# Altium project GrappleRobot_ControlBoard_V1.0.PrjPcb
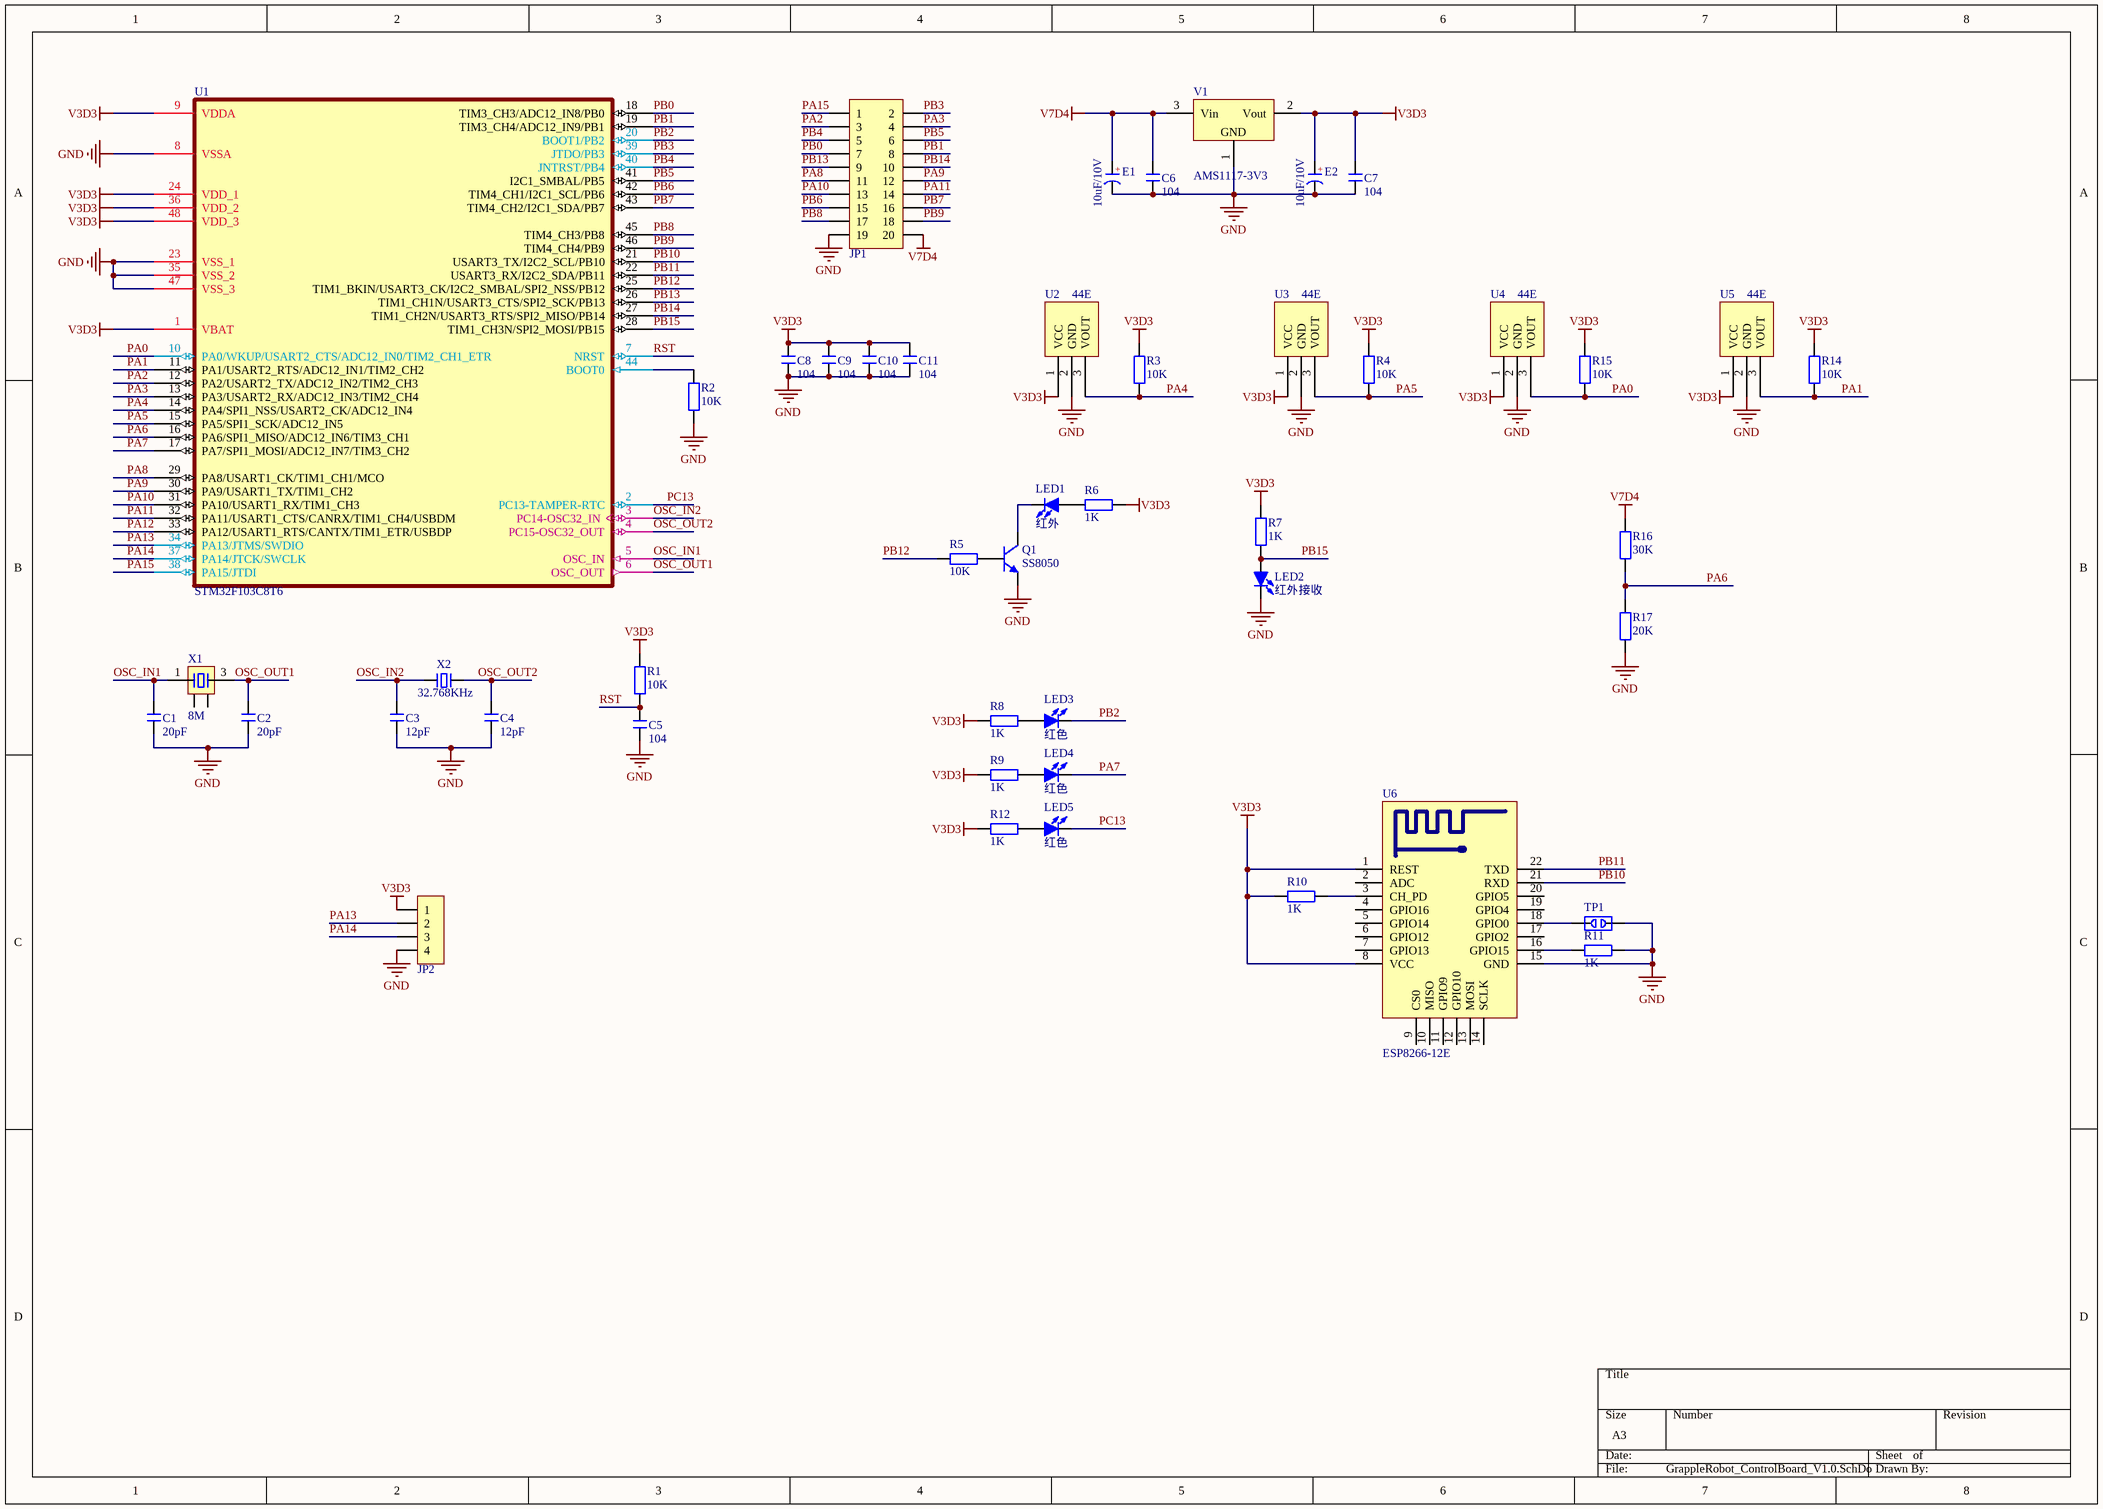
[diagram p0: GrappleRobot_ControlBoard_V1.0.SchDoc]
1 sheet, 47 parts. Net scope: global (net labels, ports and power ports of the same name join across sheets).
Board file: GrappleRobot_ControlBoard_V1.0.PcbDoc

## Sheet GrappleRobot_ControlBoard_V1.0.SchDoc
size A3

### Parts
C1  20pF  [C 0603]
C2  20pF  [C 0603]
C3  12pF  [C 0603]
C4  12pF  [C 0603]
C5  104  [C 0603]
C6  104  [C 0603]
C7  104  [C 0603]
C8  104  [C 0603]
C9  104  [C 0603]
C10  104  [C 0603]
C11  104  [C 0603]
E1  10uF/10V  [C 1206]
E2  10uF/10V  [C 1206]
JP1  Header 2X10  [HDR-10X2]  (value not drawn)
JP2  HDR-1X4  [HDR-1X4]  (value not drawn)
LED1  红外  [LED 5MM-B]
LED2  红外接收  [LED 5MM-B]
LED3  红色  [LED 0603R]
LED4  红色  [LED 0603R]
LED5  红色  [LED 0603R]
Q1  SS8050  [SOT23-3N]
R1  10K  [R 0603]
R2  10K  [R 0603]
R3  10K  [R 0603]
R4  10K  [R 0603]
R5  10K  [R 0603]
R6  1K  [R 0603]
R7  1K  [R 0603]
R8  1K  [R 0603]
R9  1K  [R 0603]
R10  1K  [R 0603]
R11  1K  [R 0603]
R12  1K  [R 0603]
R14  10K  [R 0603]
R15  10K  [R 0603]
R16  30K  [R 0603]
R17  20K  [R 0603]
TP1  (no value)  [DEBUG PAD2]
U1  STM32F103C8T6  [LQFP48]
U2  44E  [SOT23-3N]
U3  44E  [SOT23-3N]
U4  44E  [SOT23-3N]
U5  44E  [SOT23-3N]
U6  ESP8266-12E  [ESP_12E]
V1  AMS1117-3V3  [SOT223_N]
X1  8M  [XTAL-5032]
X2  32.768KHz  [XTAL-3215]

### Nets
GND: C1.1 C2.1 C3.1 C4.1 C5.1 C6.1 C7.1 C8.1 C9.1 C10.1 C11.1 E1.2(K) E2.2(K) JP1.19 JP2.4 LED2.2(K) Q1.2(E) R2.1 R11.2 R17.2 TP1.2 U1.8(VSSA) U1.23(VSS_1) U1.35(VSS_2) U1.47(VSS_3) U2.2(GND) U3.2(GND) U4.2(GND) U5.2(GND) U6.15(GND) V1.1(GND)
V3D3: C7.2 C8.2 C9.2 C10.2 C11.2 E2.1(A) JP2.1 R1.2 R3.2 R4.2 R6.1 R7.1 R8.1 R9.1 R10.1 R12.1 R14.2 R15.2 U1.1(VBAT) U1.9(VDDA) U1.24(VDD_1) U1.36(VDD_2) U1.48(VDD_3) U2.1(VCC) U3.1(VCC) U4.1(VCC) U5.1(VCC) U6.1(REST) U6.8(VCC) V1.2(Vout)
V7D4: C6.2 E1.1(A) JP1.20 R16.1 V1.3(Vin)
OSC_IN1: C1.2 U1.5(OSC_IN) X1.1
OSC_IN2: C3.2 U1.3(PC14-OSC32_IN) X2.1
OSC_OUT1: C2.2 U1.6(OSC_OUT) X1.3
OSC_OUT2: C4.2 U1.4(PC15-OSC32_OUT) X2.2
PA0: R15.1 U1.10(PA0/WKUP/USART2_CTS/ADC12_IN0/TIM2_CH1_ETR) U4.3(VOUT)
PA1: R14.1 U1.11(PA1/USART2_RTS/ADC12_IN1/TIM2_CH2) U5.3(VOUT)
PA2: JP1.3 U1.12(PA2/USART2_TX/ADC12_IN2/TIM2_CH3)
PA3: JP1.4 U1.13(PA3/USART2_RX/ADC12_IN3/TIM2_CH4)
PA4: R3.1 U1.14(PA4/SPI1_NSS/USART2_CK/ADC12_IN4) U2.3(VOUT)
PA5: R4.1 U1.15(PA5/SPI1_SCK/ADC12_IN5) U3.3(VOUT)
PA6: R16.2 R17.1 U1.16(PA6/SPI1_MISO/ADC12_IN6/TIM3_CH1)
PA7: LED4.2(K) U1.17(PA7/SPI1_MOSI/ADC12_IN7/TIM3_CH2)
PA8: JP1.11 U1.29(PA8/USART1_CK/TIM1_CH1/MCO)
PA9: JP1.12 U1.30(PA9/USART1_TX/TIM1_CH2)
PA10: JP1.13 U1.31(PA10/USART1_RX/TIM1_CH3)
PA11: JP1.14 U1.32(PA11/USART1_CTS/CANRX/TIM1_CH4/USBDM)
PA12: U1.33(PA12/USART1_RTS/CANTX/TIM1_ETR/USBDP)
PA13: JP2.2 U1.34(PA13/JTMS/SWDIO)
PA14: JP2.3 U1.37(PA14/JTCK/SWCLK)
PA15: JP1.1 U1.38(PA15/JTDI)
PB0: JP1.7 U1.18(TIM3_CH3/ADC12_IN8/PB0)
PB1: JP1.8 U1.19(TIM3_CH4/ADC12_IN9/PB1)
PB2: LED3.2(K) U1.20(BOOT1/PB2)
PB3: JP1.2 U1.39(JTDO/PB3)
PB4: JP1.5 U1.40(JNTRST/PB4)
PB5: JP1.6 U1.41(I2C1_SMBAL/PB5)
PB6: JP1.15 U1.42(TIM4_CH1/I2C1_SCL/PB6)
PB7: JP1.16 U1.43(TIM4_CH2/I2C1_SDA/PB7)
PB8: JP1.17 U1.45(TIM4_CH3/PB8)
PB9: JP1.18 U1.46(TIM4_CH4/PB9)
PB10: U1.21(USART3_TX/I2C2_SCL/PB10) U6.21(RXD)
PB11: U1.22(USART3_RX/I2C2_SDA/PB11) U6.22(TXD)
PB12: R5.2 U1.25(TIM1_BKIN/USART3_CK/I2C2_SMBAL/SPI2_NSS/PB12)
PB13: JP1.9 U1.26(TIM1_CH1N/USART3_CTS/SPI2_SCK/PB13)
PB14: JP1.10 U1.27(TIM1_CH2N/USART3_RTS/SPI2_MISO/PB14)
PB15: LED2.1(A) R7.2 U1.28(TIM1_CH3N/SPI2_MOSI/PB15)
PC13: LED5.2(K) U1.2(PC13-TAMPER-RTC)
RST: C5.2 R1.1 U1.7(NRST)
NetLED1_1: LED1.1(A) R6.2
NetLED1_2: LED1.2(K) Q1.3(C)
NetLED3_1: LED3.1(A) R8.2
NetLED4_1: LED4.1(A) R9.2
NetLED5_1: LED5.1(A) R12.2
NetQ1_1: Q1.1(B) R5.1
NetR2_2: R2.2 U1.44(BOOT0)
NetR10_2: R10.2 U6.3(CH_PD)
NetR11_1: R11.1 U6.16(GPIO15)
NetTP1_1: TP1.1 U6.18(GPIO0)

Not connected (* = marked no-connect by the designer): U6 2(ADC) 4(GPIO16) 5(GPIO14) 6(GPIO12) 7(GPIO13) 9(CS0) 10(MISO) 11(GPIO9) 12(GPIO10) 13(MOSI) 14(SCLK) 17(GPIO2) 19(GPIO4) 20(GPIO5); X1 2 4

### Notes on the sheet
- (in symbol C-CM) +

### Library data of the parts
C1-C11 = C: 无极性贴片电容; 版权归属: 黎明电子style; BOM名称: 无极性贴片电容; 学习资源: https://lmdzstyle.taobao.com/
E1 E2 = C-CM: 贴片电解电容; 版权归属: 黎明电子style; BOM名称: 贴片电解电容; 学习资源: https://lmdzstyle.taobao.com/
JP1 = Header 10X2: 10*2P接插件; 版权归属: 黎明电子style; BOM名称: 10*2P接插件; 学习资源: https://lmdzstyle.taobao.com/
JP2 = Header 4: 4P接插件; 版权归属: 黎明电子style; BOM名称: 4P接插件; 学习资源: https://lmdzstyle.taobao.com/
LED1-LED5 = LED-5MM: 5mm插件LED; 版权归属: 黎明电子style; BOM名称: 5mm插件LED; 学习资源: https://lmdzstyle.taobao.com/
Q1 = 8050-SMD: 高频放大-NPN型; 版权归属: 黎明电子style; 属性: 40V 1.5A 1W 100MHZ; BOM名称: 高频放大-NPN型; 学习资源: https://lmdzstyle.taobao.com/
R1-R12 R14-R17 = R: 贴片电阻; 版权归属: 黎明电子style; BOM名称: 贴片电阻; 学习资源: https://lmdzstyle.taobao.com/
TP1 = DEBUG: 调试断点焊盘; 版权归属: 黎明电子style; BOM名称: 调试断点焊盘; 学习资源: https://lmdzstyle.taobao.com/
U1 = STM32F103C8T6: STM32 ARM-based 32-bit MCU with 64 Kbytes Flash, 48-pin LQFP, Industrial Temperature; Published: *; DatasheetVersion: *; PackageVersion: *; PackageReference: *; Publisher: *; PackageDescription: *; ComponentLink1Description: *; ComponentLink1URL: *; ComponentLink2Description: *; ComponentLink2URL: *
U6 = ESP8266-12E: 串口 WIFI模块，ESP-12E; BOM名称: WIFI模块; 版权归属: 黎明电子style; 学习资源: https://lmdzstyle.taobao.com/
V1 = AMS1117: 三端稳压芯片; BOM名称: 稳压芯片; 版权归属: 黎明电子style; 学习资源: https://lmdzstyle.taobao.com/
X1 = XTAL-4: 4脚晶振; 版权归属: 黎明电子style; BOM名称: 4脚晶振; 学习资源: https://lmdzstyle.taobao.com/
X2 = XTAL-2: 2脚晶振; 版权归属: 黎明电子style; BOM名称: 2脚晶振; 学习资源: https://lmdzstyle.taobao.com/